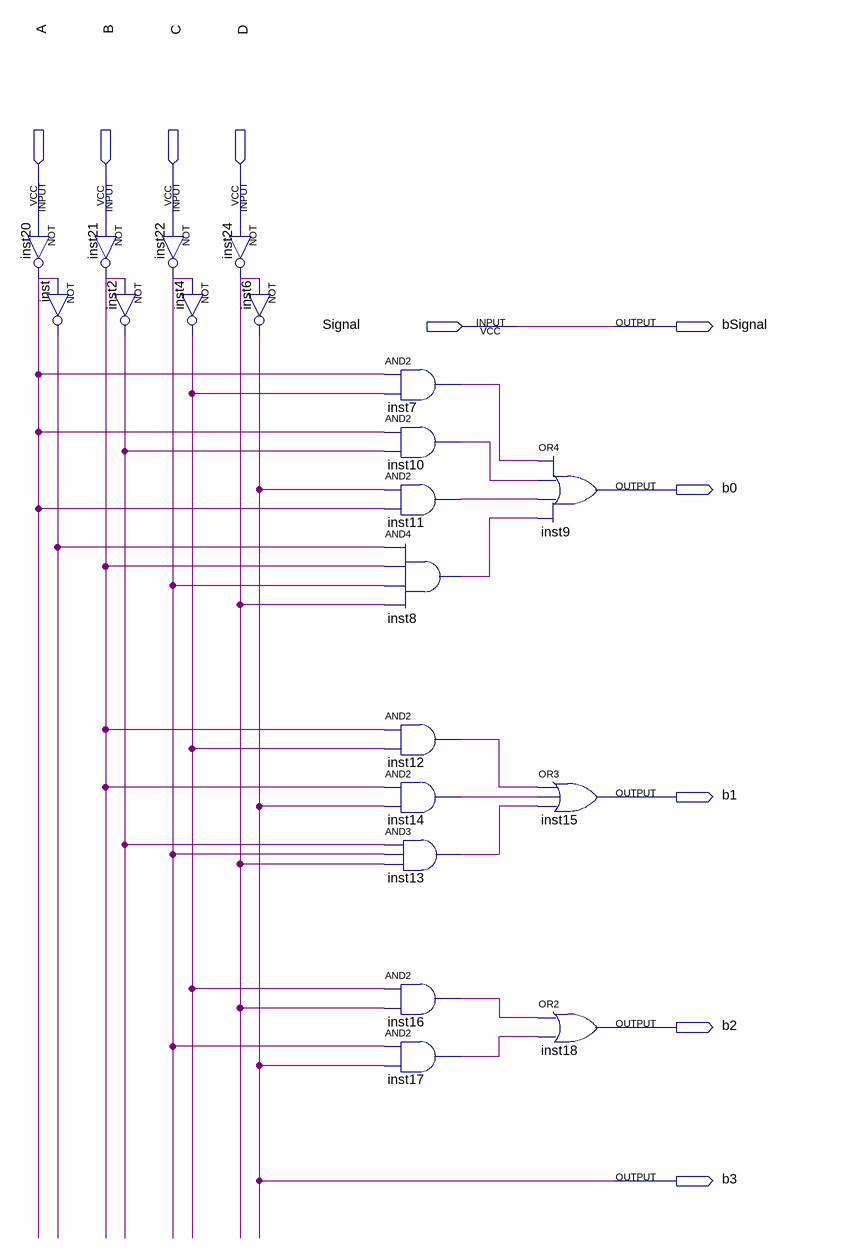
[diagram p0: schematic sheet]
// Quartus schematic ComplementoDeDois.bdf as structural Verilog: 20 symbols, 10 pins
module ComplementoDeDois (
  input  A,
  input  B,
  input  C,
  input  D,
  input  Signal,
  output bSignal,
  output b0,
  output b1,
  output b2,
  output b3
);

  wire inst2_out, inst4_out, inst7_out, inst8_out, inst10_out, inst11_out, inst12_out, inst13_out,
       inst14_out, inst16_out, inst17_out, inst20_out, inst21_out, inst22_out, inst24_out, inst_out;

  not inst20 (inst20_out, A);
  not inst (inst_out, inst20_out);
  not inst21 (inst21_out, B);
  not inst2 (inst2_out, inst21_out);
  not inst22 (inst22_out, C);
  not inst4 (inst4_out, inst22_out);
  not inst24 (inst24_out, D);
  not inst6 (b3, inst24_out);
  and inst7 (inst7_out, inst20_out, inst4_out);
  and inst10 (inst10_out, inst20_out, inst2_out);
  and inst11 (inst11_out, b3, inst20_out);
  and inst8 (inst8_out, inst_out, inst21_out, inst22_out, inst24_out);
  and inst12 (inst12_out, inst21_out, inst4_out);
  and inst14 (inst14_out, inst21_out, b3);
  and inst13 (inst13_out, inst2_out, inst22_out, inst24_out);
  and inst16 (inst16_out, inst4_out, inst24_out);
  and inst17 (inst17_out, inst22_out, b3);
  or inst9 (b0, inst7_out, inst10_out, inst11_out, inst8_out);
  or inst15 (b1, inst12_out, inst14_out, inst13_out);
  or inst18 (b2, inst16_out, inst17_out);

  assign bSignal = Signal;
endmodule
